# Altium schematic sheet SSL-2020-MCUBoard1.SchDoc
size A4
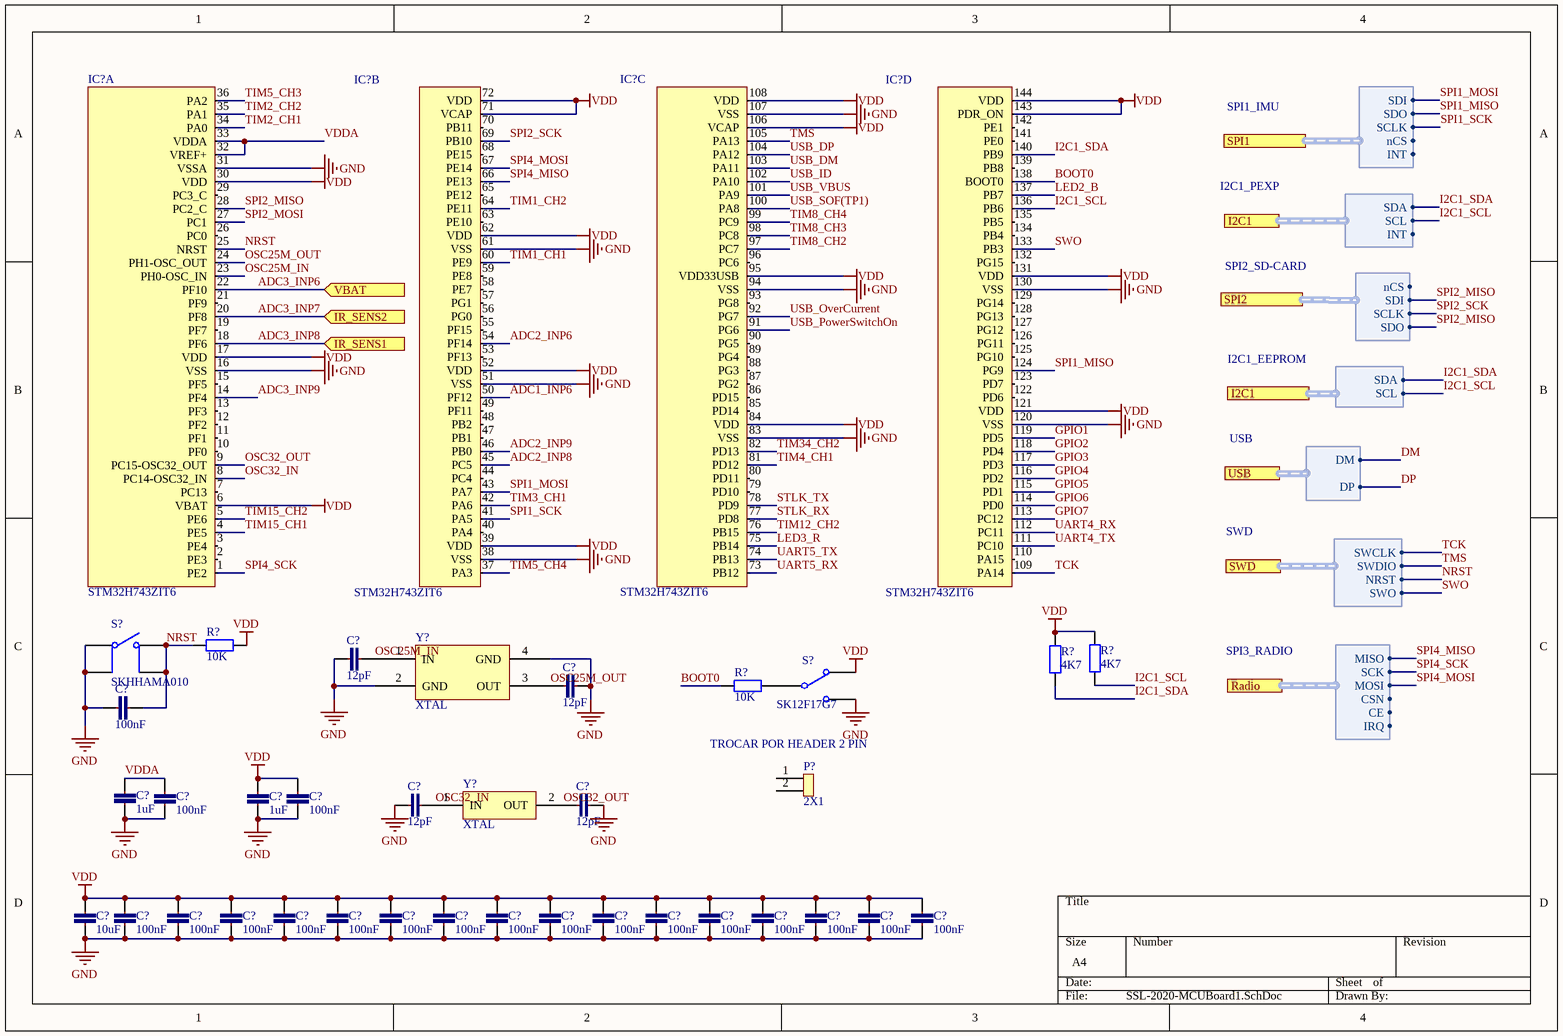
[diagram p0: SSL-2020-MCUBoard1.SchDoc]

## Parts
(Parts that share a designator on the sheet are numbered #1, #2 ... from top to bottom, then left to right.)
C?#1  12pF  [CAP CER 0603]
C?#2  12pF  [CAP CER 0603]
C?#3  100nF  [CAP CER 0603]
C?#4  1uF  [CAP CER 0603]
C?#5  100nF  [CAP CER 0603]
C?#6  1uF  [CAP CER 0603]
C?#7  100nF  [CAP CER 0603]
C?#8  12pF  [CAP CER 0603]
C?#9  12pF  [CAP CER 0603]
C?#10  10uF  [CAP CER 0603]
C?#11  100nF  [CAP CER 0603]
C?#12  100nF  [CAP CER 0603]
C?#13  100nF  [CAP CER 0603]
C?#14  100nF  [CAP CER 0603]
C?#15  100nF  [CAP CER 0603]
C?#16  100nF  [CAP CER 0603]
C?#17  100nF  [CAP CER 0603]
C?#18  100nF  [CAP CER 0603]
C?#19  100nF  [CAP CER 0603]
C?#20  100nF  [CAP CER 0603]
C?#21  100nF  [CAP CER 0603]
C?#22  100nF  [CAP CER 0603]
C?#23  100nF  [CAP CER 0603]
C?#24  100nF  [CAP CER 0603]
C?#25  100nF  [CAP CER 0603]
C?#26  100nF  [CAP CER 0603]
IC?#1  STM32H743ZIT6  [LQFP-144]  (part A of 4)
IC?#2  STM32H743ZIT6  [LQFP-144]  (part B of 4)
IC?#3  STM32H743ZIT6  [LQFP-144]  (part C of 4)
IC?#4  STM32H743ZIT6  [LQFP-144]  (part D of 4)
P?  2X1  [HEADER 2X1 MALE]
R?#1  10K  [RES SMD 0603]
R?#2  4K7  [RES SMD 0603]
R?#3  4K7  [RES SMD 0603]
R?#4  10K  [RES SMD 0603]
S?#1  SKHHAMA010  [TACT-SWITCH-6X6X5]
S?#2  SK12F17G7  [SPDT-SWITCH]
Y?#1  XTAL  [XTAL-200X160]
Y?#2  XTAL  [XTAL-200X120]

## Ports
I2C1 (harness I2C1_EEPROM), I2C1 (harness I2C1_PEXP), IR_SENS1 (in), IR_SENS2 (in), Radio (harness SPI3_RADIO), SPI1 (harness SPI1_IMU), SPI2 (harness SPI2_SD-CARD), SWD (harness SWD), USB (harness USB), VBAT (in)

## Harnesses
SPI1_IMU: SDI, SDO, SCLK, nCS, INT
I2C1_PEXP: SDA, SCL, INT
SPI2_SD-CARD: nCS, SDI, SCLK, SDO
I2C1_EEPROM: SDA, SCL
SWD: SWCLK, SWDIO, NRST, SWO
USB: DM, DP
SPI3_RADIO: MISO, SCK, MOSI, CSN, CE, IRQ

## Nets
GND: C?#1.1 C?#2.2 C?#3.1 C?#4.2 C?#5.2 C?#6.2 C?#7.2 C?#8.1 C?#9.2 C?#10.2 C?#11.2 C?#12.2 C?#13.2 C?#14.2 C?#15.2 C?#16.2 C?#17.2 C?#18.2 C?#19.2 C?#20.2 C?#21.2 C?#22.2 C?#23.2 C?#24.2 C?#25.2 C?#26.2 IC?#1.16(VSS) IC?#1.31(VSSA) IC?#2.38(VSS) IC?#2.51(VSS) IC?#2.61(VSS) IC?#3.83(VSS) IC?#3.94(VSS) IC?#3.107(VSS) IC?#4.120(VSS) IC?#4.130(VSS) S?#1.1 S?#1.2 S?#2.3(NO1) Y?#1.2(GND) Y?#1.4(GND)
VDD: C?#6.1 C?#7.1 C?#10.1 C?#11.1 C?#12.1 C?#13.1 C?#14.1 C?#15.1 C?#16.1 C?#17.1 C?#18.1 C?#19.1 C?#20.1 C?#21.1 C?#22.1 C?#23.1 C?#24.1 C?#25.1 C?#26.1 IC?#1.6(VBAT) IC?#1.17(VDD) IC?#1.30(VDD) IC?#2.39(VDD) IC?#2.52(VDD) IC?#2.62(VDD) IC?#2.71(VCAP) IC?#2.72(VDD) IC?#3.84(VDD) IC?#3.95(VDD33USB) IC?#3.106(VCAP) IC?#3.108(VDD) IC?#4.121(VDD) IC?#4.131(VDD) IC?#4.143(PDR_ON) IC?#4.144(VDD) R?#1.1 R?#2.2 R?#3.2 S?#2.1(NC1)
ADC1_INP6: IC?#2.50(PF12)
ADC2_INP6: IC?#2.54(PF14)
ADC2_INP8: IC?#2.45(PC5)
ADC2_INP9: IC?#2.46(PB0)
ADC3_INP6: IC?#1.22(PF10) ; port VBAT
ADC3_INP7: IC?#1.20(PF8) ; port IR_SENS2
ADC3_INP8: IC?#1.18(PF6) ; port IR_SENS1
ADC3_INP9: IC?#1.14(PF4)
BOOT0: IC?#4.138(BOOT0) R?#4.2
DM: port USB.DM
DP: port USB.DP
GPIO1: IC?#4.119(PD5)
GPIO2: IC?#4.118(PD4)
GPIO3: IC?#4.117(PD3)
GPIO4: IC?#4.116(PD2)
GPIO5: IC?#4.115(PD1)
GPIO6: IC?#4.114(PD0)
GPIO7: IC?#4.113(PC12)
I2C1_SCL: IC?#4.136(PB6) R?#3.1 ; port I2C1.SCL
I2C1_SDA: IC?#4.140(PB9) R?#2.1 ; port I2C1.SDA
LED2_B: IC?#4.137(PB7)
LED3_R: IC?#3.75(PB14)
NRST: C?#3.2 IC?#1.25(NRST) R?#1.2 S?#1.3 S?#1.4 ; port SWD.NRST
OSC25M_IN: C?#1.2 IC?#1.23(PH0-OSC_IN) Y?#1.1(IN)
OSC25M_OUT: C?#2.1 IC?#1.24(PH1-OSC_OUT) Y?#1.3(OUT)
OSC32_IN: C?#8.2 IC?#1.8(PC14-OSC32_IN)
OSC32_OUT: C?#9.1 IC?#1.9(PC15-OSC32_OUT)
SPI1_MISO: IC?#4.124(PG9) ; port SPI1.SDO
SPI1_MOSI: IC?#2.43(PA7) ; port SPI1.SDI
SPI1_SCK: IC?#2.41(PA5) ; port SPI1.SCLK
SPI2_MISO: IC?#1.28(PC2_C) ; port SPI2.SDI, port SPI2.SDO
SPI2_MOSI: IC?#1.27(PC1)
SPI2_SCK: IC?#2.69(PB10) ; port SPI2.SCLK
SPI4_MISO: IC?#2.66(PE13) ; port Radio.MISO
SPI4_MOSI: IC?#2.67(PE14) ; port Radio.MOSI
SPI4_SCK: IC?#1.1(PE2) ; port Radio.SCK
STLK_RX: IC?#3.77(PD8)
STLK_TX: IC?#3.78(PD9)
SWO: IC?#4.133(PB3) ; port SWD.SWO
TCK: IC?#4.109(PA14) ; port SWD.SWCLK
TIM1_CH1: IC?#2.60(PE9)
TIM1_CH2: IC?#2.64(PE11)
TIM2_CH1: IC?#1.34(PA0)
TIM2_CH2: IC?#1.35(PA1)
TIM3_CH1: IC?#2.42(PA6)
TIM4_CH1: IC?#3.81(PD12)
TIM5_CH3: IC?#1.36(PA2)
TIM5_CH4: IC?#2.37(PA3)
TIM8_CH2: IC?#3.97(PC7)
TIM8_CH3: IC?#3.98(PC8)
TIM8_CH4: IC?#3.99(PC9)
TIM12_CH2: IC?#3.76(PB15)
TIM15_CH1: IC?#1.4(PE5)
TIM15_CH2: IC?#1.5(PE6)
TIM34_CH2: IC?#3.82(PD13)
TMS: IC?#3.105(PA13) ; port SWD.SWDIO
UART4_RX: IC?#4.112(PC11)
UART4_TX: IC?#4.111(PC10)
UART5_RX: IC?#3.73(PB12)
UART5_TX: IC?#3.74(PB13)
USB_DM: IC?#3.103(PA11)
USB_DP: IC?#3.104(PA12)
USB_ID: IC?#3.102(PA10)
USB_OverCurrent: IC?#3.92(PG7)
USB_PowerSwitchOn: IC?#3.91(PG6)
USB_SOF(TP1): IC?#3.100(PA8)
USB_VBUS: IC?#3.101(PA9)
VDDA: C?#4.1 C?#5.1 IC?#1.32(VREF+) IC?#1.33(VDDA)
NetR?#4_1: R?#4.1 S?#2.2(COMMON1)

Not connected (* = marked no-connect by the designer): IC?#1 2(PE3) 3(PE4) 7(PC13) 10(PF0) 11(PF1) 12(PF2) 13(PF3) 15(PF5) 19(PF7) 21(PF9) 26(PC0) 29(PC3_C); IC?#2 40(PA4) 44(PC4) 47(PB1) 48(PB2) 49(PF11) 53(PF13) 55(PF15) 56(PG0) 57(PG1) 58(PE7) 59(PE8) 63(PE10) 65(PE12) 68(PE15) 70(PB11); IC?#3 79(PD10) 80(PD11) 85(PD14) 86(PD15) 87(PG2) 88(PG3) 89(PG4) 90(PG5) 93(PG8) 96(PC6); IC?#4 110(PA15) 122(PD6) 123(PD7) 125(PG10) 126(PG11) 127(PG12) 128(PG13) 129(PG14) 132(PG15) 134(PB4) 135(PB5) 139(PB8) 141(PE0) 142(PE1); P? 1 2; Y?#2 1(IN) 2(OUT)

## Notes on the sheet
- TROCAR POR HEADER 2 PIN

## Library data of the parts
C?#1 C?#2 C?#8 C?#9 = CAP CER 0603 50V 12pF: Multilayer Ceramic Capacitors MLCC - SMD/SMT 50V 12pF 0603 C0G 5%; Mfr Nr: C0603C120J5GAC; Mfr: KEMET; Type: Ceramic Capacitor; Dimensions: 0603 (1608 metric); Series: SMD Comm C0G; Voltage Rating: 50V; Value: 12pF
C?#3 C?#5 C?#7 C?#11-C?#26 = CAP CER 0603 25V 100nF: Multilayer Ceramic Capacitors MLCC - SMD/SMT 25V 0.1uF 0603 Y5V -20/+80%; Mfr Nr: C0603C104Z3VACTU; Mfr: KEMET; Type: Ceramic Capacitor; Dimensions: 0603 (1608 metric); Voltage Rating: 25V; Series: SMD Comm Y5V; Value: 100nF
C?#4 C?#6 = CAP CER 0603 25V 1uF: Multilayer Ceramic Capacitors MLCC - SMD/SMT 1uF 25V X5R 10%; Mfr Nr: C0603C105K3PAC7411; Mfr: KEMET; Type: Ceramic Capacitor; Dimensions: 0603 (1608 metric); Voltage Rating: 25V; Series: SMD Comm X5R; Value: 1uF
C?#10 = CAP CER 0603 6.3V 10uF: Multilayer Ceramic Capacitors MLCC - SMD/SMT 0603 6.3V 10uF X5R 10% Soft Term; Mfr Nr: C1608X5R0J106K080AE; Mfr: TDK; Type: Ceramic Capacitor; Dimensions: 0603 (1608 metric); Voltage Rating: 6.3V; Series: C; Value: 10uF
IC?#1-IC?#4 = STM32H743ZIT6: ARM Microcontrollers - MCU High-performance and DSP with DP-FPU, ARM Cortex-M7 MCU with 2MBytes Flash, 1MB RAM, 400 MHz CPU, Art Accelerator, L1 cache, external memory interface, large set of peripherals; Mfr: STMicroelectronics; Core: ARM Cortex M7; Mfr Nr: STM32H743ZIT6; Package: LQFP-144; Series: STM32H743ZI
P? = HEADER 2P M
R?#1 R?#4 = RES SMD 0603 10K: Thick Film Resistors - SMD 1/10Watt 10Kohms 1% Commercial Use; Mfr: Vishay / Dale; Mfr Nr: CRCW060310K0FKEAC; Power Rating: 1/10 W; Dimensions: 0603 (1608 metric); Value: 10K
R?#2 R?#3 = RES SMD 0603 4K7
S?#1 = SKHHAMA010: Tactile Switches 6.0x6.0x5.0mm 160gf; Mfr: ALPS; Contact Form: SPST; Voltage Rating: 12 VDC; Current Rating: 50 mA; Mfr Nr: SKHHAMA010; Series: SKHH; Type: Tactile Switch
S?#2 = SK12F17G7: Slide Switches SPDT 0.3 Amp at 30 V; Mfr: C&K; Current Rating: 300 mA; Voltage Rating: 30 VDC; Contact Form: SPDT; Type: Slide Switch; Series: SK; Mfr Nr: SK12F17G7
Y?#1 = FA-12825F10Z-AC: Crystals 25MHz 10PPM -20C +75C 9.0pF; Mfr Nr: FA-128  25.0000MF10Z-AC; Mfr: Epson Timing; Load Capacitance: 9 pF; ESR: 80 Ohms; Package: 2 mm x 1.6 mm; Frequency: 25 MHz; Series: FA-128; Tolerance: 10 PPM
Y?#2 = ABS06-32.768KHZ-9-T: Crystals 32.768KHz 9pF 20ppm -40 C+85C; Mfr: ABRACON; ESR: 90 kOhms; Mfr Nr: ABS06-32.768KHZ-9-T; Package: 2 mm x 1.6 mm; Load Capacitance: 9 pF; Frequency: 32.768 kHz; Series: ABS06; Tolerance: 20 PPM